# EAGLE design Z05_C8V_02 (EAGLE 6.3)
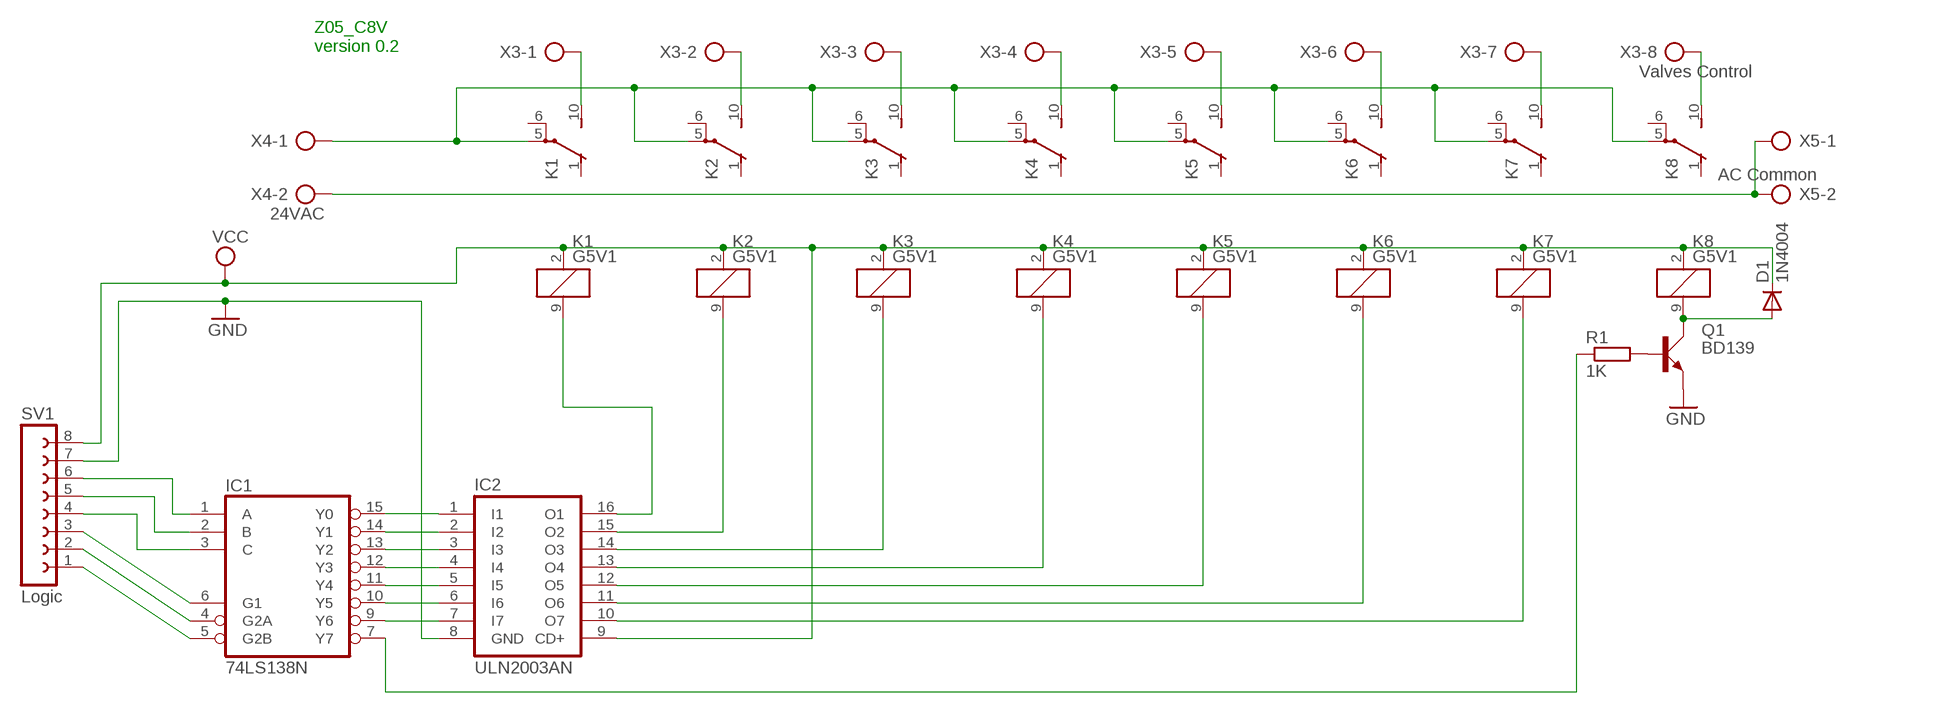
[diagram p0: schematic, sheet 1]

## Parts
D1  1N4004  [DO41-10]
IC1  74LS138N  [DIL16]
IC2  ULN2003AN  [DIL16]
K1  G5V1  [G5V1]
K2  G5V1  [G5V1]
K3  G5V1  [G5V1]
K4  G5V1  [G5V1]
K5  G5V1  [G5V1]
K6  G5V1  [G5V1]
K7  G5V1  [G5V1]
K8  G5V1  [G5V1]
Q1  BD139  [TO126AV]
R1  1K  R-EU_0204/7  [0204/7]
SV1  Logic  FE08-1  [FE08]
X3  Valves Control  AK500/8  [AK500/8]
X4  24VAC  AK500/2  [AK500/2]
X5  AC Common  AK500/2  [AK500/2]

## Nets
GND: IC2.8(GND) Q1.E SV1.7
N$1: IC2.15(O2) K2.9
N$2: IC1.15(Y0) IC2.1(I1)
N$3: IC1.13(Y2) IC2.3(I3)
N$4: IC1.12(Y3) IC2.4(I4)
N$5: IC1.11(Y4) IC2.5(I5)
N$6: IC1.10(Y5) IC2.6(I6)
N$7: IC1.9(Y6) IC2.7(I7)
N$8: K1.5(2:P) K2.5(2:P) K3.5(2:P) K4.5(2:P) K5.5(2:P) K6.5(2:P) K7.5(2:P) K8.5(2:P) X4.1
N$9: IC1.14(Y1) IC2.2(I2)
N$10: X4.2 X5.1 X5.2
N$11: K1.10(2:S) X3.1
N$12: K2.10(2:S) X3.2
N$13: K3.10(2:S) X3.3
N$14: K4.10(2:S) X3.4
N$15: K5.10(2:S) X3.5
N$16: K6.10(2:S) X3.6
N$17: K7.10(2:S) X3.7
N$18: K8.10(2:S) X3.8
N$20: D1.A K8.9 Q1.C
N$21: IC2.16(O1) K1.9
N$22: Q1.B R1.2
N$23: IC1.7(Y7) R1.1
N$24: IC2.14(O3) K3.9
N$25: IC2.13(O4) K4.9
N$26: IC2.12(O5) K5.9
N$27: IC2.11(O6) K6.9
N$28: IC2.10(O7) K7.9
N$42: IC1.1(A) SV1.6
N$43: IC1.2(B) SV1.5
N$44: IC1.3(C) SV1.4
N$45: IC1.6(G1) SV1.3
N$46: IC1.4(G2A) SV1.2
N$47: IC1.5(G2B) SV1.1
VCC: D1.C IC2.9(CD+) K1.2 K2.2 K3.2 K4.2 K5.2 K6.2 K7.2 K8.2 SV1.8
Unconnected: K1.1(2:O) K1.6(2:P) K2.1(2:O) K2.6(2:P) K3.1(2:O) K3.6(2:P) K4.1(2:O) K4.6(2:P) K5.1(2:O) K5.6(2:P) K6.1(2:O) K6.6(2:P) K7.1(2:O) K7.6(2:P) K8.1(2:O) K8.6(2:P)

## Notes on the sheet
- Z05_C8V
  version 0.2

## Power pins joined to a net without a drawn wire
GND: IC1.8(GND)
VCC: IC1.16(VCC)

## Library data of the parts
D1 = diode:1N4004: DIODE general purpose rectifier, 1 A
IC1 = 74xx-eu:74*138: 3-line to 8-line DECODER/DEMULTIPLEXER
IC2 = uln-udn:ULN2003A: DRIVER ARRAY
K1-K8 = relay:G5V1: RELAY 1 x switch, 0.5 A/125 V AC, 1 A/24 V DC , Omron; MPN: G5V-1-DC24; OC_FARNELL: 9949593; OC_NEWARK: 36M6377
Q1 = transistor-power:BD139: NPN TRANSISTOR
R1 = rcl:R-EU_: RESISTOR, European symbol
SV1 = con-lsta:FE08-1: FEMALE HEADER; OC_FARNELL: unknown; OC_NEWARK: unknown
X3 = con-ptr500:AK500/8: CONNECTOR; OC_FARNELL: unknown; OC_NEWARK: unknown
X4 X5 = con-ptr500:AK500/2: CONNECTOR; OC_FARNELL: unknown; OC_NEWARK: unknown

## Board
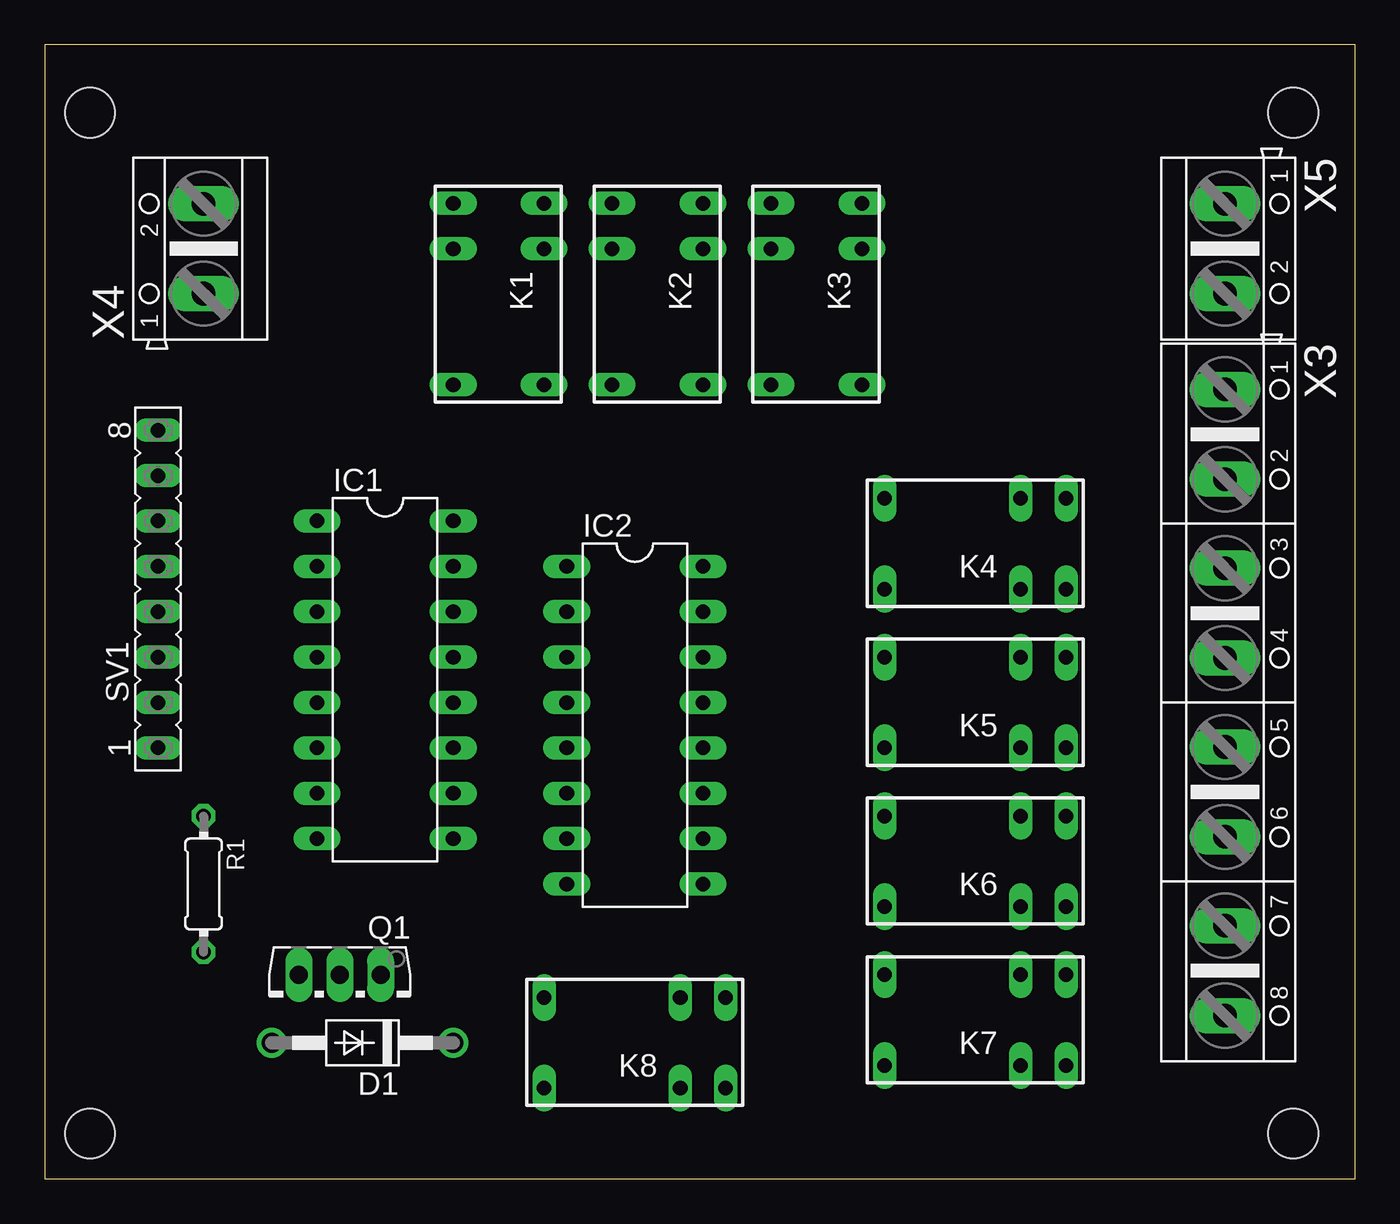
[diagram p1: board, top side]
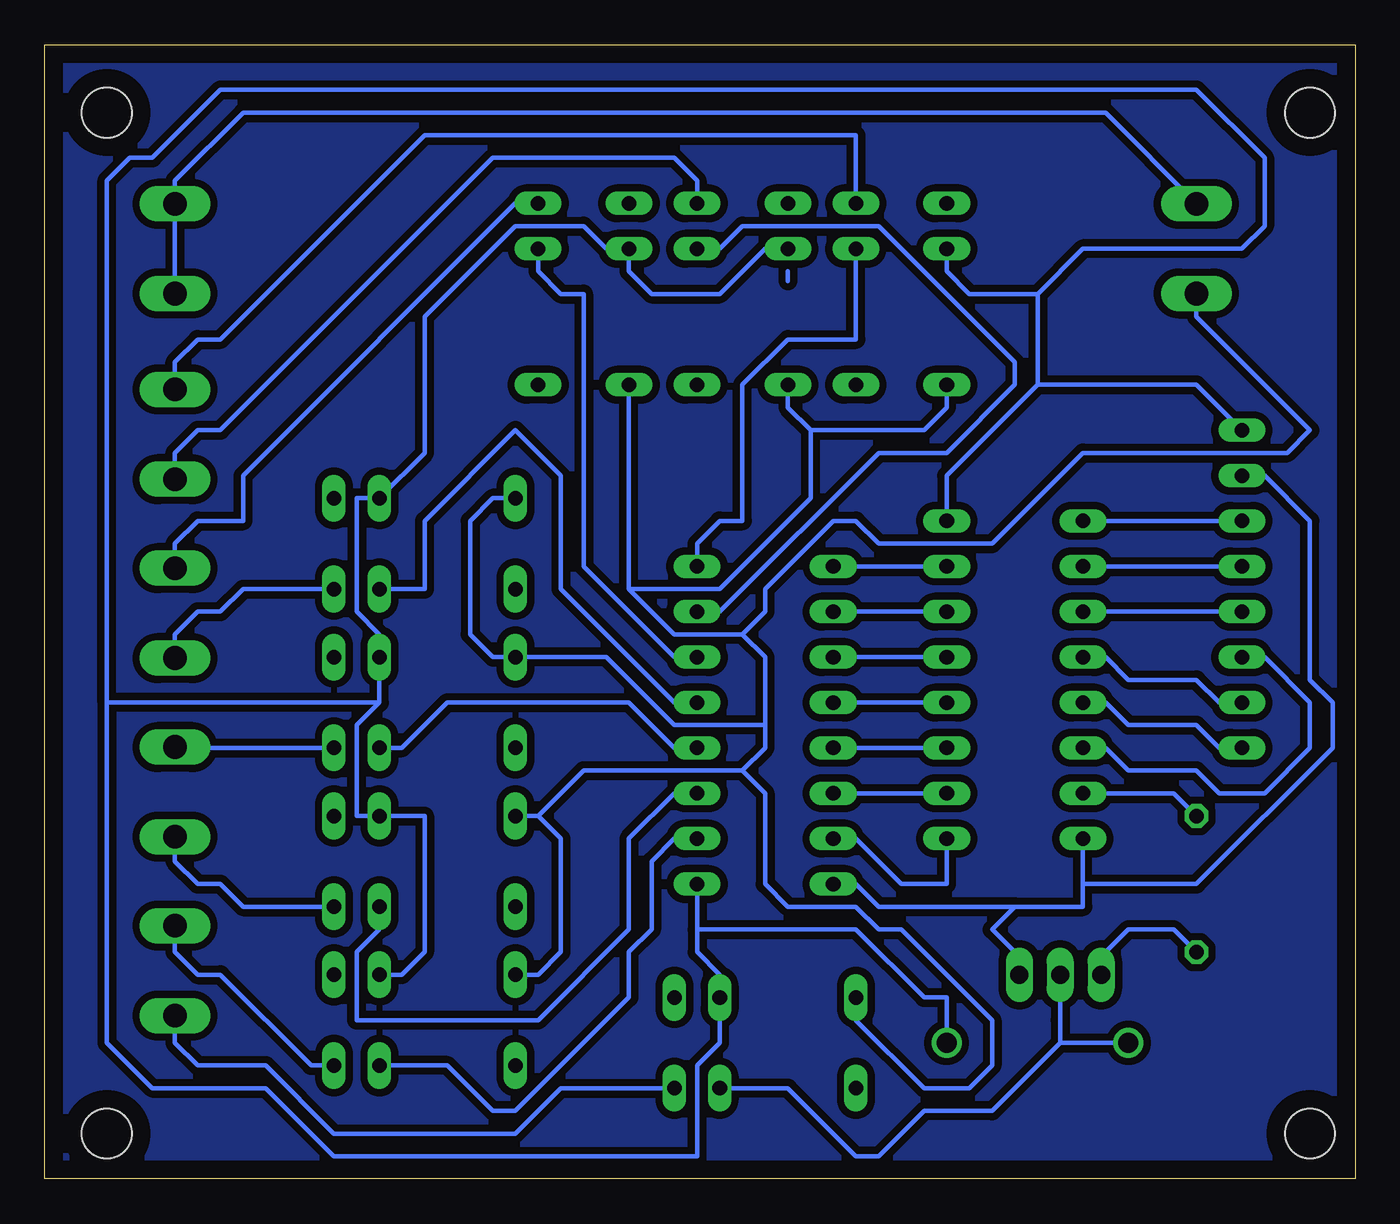
[diagram p2: board, bottom side, seen from below]

Size 73.33 x 63.49 mm. Coordinates in mm from the lower left corner, seen from the top.
Outline: 0,0 73.33,0 73.33,63.49 0,63.49 0,0
Copper layers (1*16): Top 0mil / dielectric 1.5mm / Bottom 0.035mm
Design rules "default *": minimum track width 10mil, minimum drill 24mil, track to track 16mil, track to pad 16mil, pad to pad 16mil, via to via 16mil, smd to smd 8mil, copper to edge 40mil, drill to drill 8mil, minimum pad ring 10mil, minimum via ring 8mil, stop-mask expansion 4mil, vias tented up to drill 0mil, thermal gap 10mil
Holes 2.8 mm at 2.54,59.69 2.54,2.54 69.85,59.69 69.85,2.54

### Footprints (pad centres in the part's own frame; a part is rotated, then mirrored left to right if it is on the bottom)
DO41-10 = drill 1.118: A 5.08,0; C -5.08,0
DIL16 = drill 0.813 long: 1 -8.89,-3.81; 2 -6.35,-3.81; 3 -3.81,-3.81; 4 -1.27,-3.81; 5 1.27,-3.81; 6 3.81,-3.81; 7 6.35,-3.81; 8 8.89,-3.81; 9 8.89,3.81; 10 6.35,3.81; 11 3.81,3.81; 12 1.27,3.81; 13 -1.27,3.81; 14 -3.81,3.81; 15 -6.35,3.81; 16 -8.89,3.81
G5V1 = drill 0.813 long: 1 -5.08,-2.54; 2 -2.54,-2.54; 5 5.08,-2.54; 6 5.08,2.54; 9 -2.54,2.54; 10 -5.08,2.54
TO126AV = drill 1.016 long: B 2.286,-1.27; C 0,-1.27; E -2.286,-1.27
0204/7 = drill 0.813 octagon: 1 -3.81,0; 2 3.81,0
FE08 = drill 0.813 long: 1 -8.89,0; 2 -6.35,0; 3 -3.81,0; 4 -1.27,0; 5 1.27,0; 6 3.81,0; 7 6.35,0; 8 8.89,0
AK500/8 = drill 1.321 long: 1 -17.526,0; 2 -12.497,0; 3 -7.518,0; 4 -2.489,0; 5 2.489,0; 6 7.518,0; 7 12.497,0; 8 17.526,0
AK500/2 = drill 1.321 long: 1 -2.515,0; 2 2.515,0

### Placement (x,y rotation side)
D1  17.78,7.62 180 top
IC1  19.05,27.94 270 top
IC2  33.02,25.4 270 top
K1  25.4,49.53 270 top
K2  34.29,49.53 270 top
K3  43.18,49.53 270 top
K4  52.07,35.56 180 top
K5  52.07,26.67 180 top
K6  52.07,17.78 180 top
K7  52.07,8.89 180 top
K8  33.02,7.62 180 top
Q1  16.51,10.16 180 top
R1  8.89,16.51 270 top
SV1  6.35,33.02 90 top
X3  66.04,26.67 270 top
X4  8.89,52.07 90 top
X5  66.04,52.07 270 top

### Tracks (layer width: path | path; a pad name or v marks a point on that pad's centre or on a via)
GND
  Bottom 0.254: 15.24,16.51 15.24,15.24 19.05,15.24 | 15.24,16.51 IC1.8 | 19.05,15.24 20.32,13.97 19.05,12.7 19.05,11.43 Q1.E | IC2.8 27.94,16.51 26.67,15.24 19.05,15.24 | SV1.7 5.08,39.37 2.54,36.83 2.54,27.94 1.27,26.67 1.27,24.13 8.89,16.51 15.24,16.51
N$1
  Bottom 0.254: IC2.15 35.56,31.75 26.67,40.64 22.86,40.64 19.05,44.45 19.05,45.72 26.67,53.34 34.29,53.34 35.56,52.07 K2.9
N$2
  Bottom 0.254: IC2.1 IC1.15
N$3
  Bottom 0.254: IC2.3 IC1.13
N$4
  Bottom 0.254: IC2.4 IC1.12
N$5
  Bottom 0.254: IC2.5 IC1.11
N$6
  Bottom 0.254: IC2.6 IC1.10
N$7
  Bottom 0.254: IC1.9 22.86,16.51 25.4,16.51 27.94,19.05 IC2.7
N$8
  Bottom 0.254: K1.5 22.86,43.18 24.13,41.91 30.48,41.91 | 30.48,41.91 31.75,43.18 K2.5 | K4.5 48.26,38.1 49.53,36.83 49.53,30.48 48.26,29.21 K5.5 41.91,29.21 38.1,25.4 33.02,25.4 | K8.5 27.94,8.89 24.13,5.08 21.59,5.08 20.32,6.35 20.32,8.89 25.4,13.97 26.67,13.97 27.94,15.24 31.75,15.24 33.02,16.51 33.02,21.59 34.29,22.86 | 34.29,22.86 43.18,22.86 45.72,20.32 | K6.5 45.72,20.32 | K7.5 45.72,11.43 44.45,12.7 44.45,19.05 45.72,20.32 | 40.64,33.02 K3.5 | 40.64,33.02 38.1,30.48 34.29,30.48 | 34.29,30.48 33.02,29.21 33.02,25.4 | 33.02,25.4 33.02,24.13 34.29,22.86 | X4.1 8.89,48.26 2.54,41.91 3.81,40.64 15.24,40.64 20.32,35.56 26.67,35.56 27.94,36.83 29.21,36.83 33.02,33.02 33.02,31.75 34.29,30.48 | 30.48,41.91 30.48,38.1 35.56,33.02 40.64,33.02
N$9
  Bottom 0.254: IC2.2 IC1.14
N$10
  Bottom 0.254: X4.2 13.97,59.69 62.23,59.69 66.04,55.88 X5.1 X5.2 66.04,49.53
N$11
  Bottom 0.254: K1.10 27.94,58.42 52.07,58.42 63.5,46.99 64.77,46.99 66.04,45.72 X3.1
N$12
  Bottom 0.254: K2.10 36.83,55.88 38.1,57.15 48.26,57.15 63.5,41.91 64.77,41.91 66.04,40.64 X3.2
N$13
  Bottom 0.254: K3.10 46.99,54.61 62.23,39.37 62.23,36.83 64.77,36.83 66.04,35.56 X3.3
N$14
  Bottom 0.254: K4.10 62.23,33.02 63.5,31.75 64.77,31.75 66.04,30.48 X3.4
N$15
  Bottom 0.254: K5.10 66.04,24.13 X3.5
N$16
  Bottom 0.254: K6.10 62.23,15.24 63.5,16.51 64.77,16.51 66.04,17.78 X3.6
N$17
  Bottom 0.254: K7.10 58.42,6.35 63.5,11.43 64.77,11.43 66.04,12.7 X3.7
N$18
  Bottom 0.254: K8.10 44.45,5.08 46.99,2.54 57.15,2.54 60.96,6.35 64.77,6.35 66.04,7.62 X3.8
N$19
  Bottom 0.254: 31.75,50.8 31.75,50.27
N$20
  Bottom 0.254: K8.9 31.75,5.08 27.94,1.27 26.67,1.27 24.13,3.81 20.32,3.81 16.51,7.62 | 16.51,7.62 16.51,8.89 Q1.C | 16.51,7.62 D1.A
N$21
  Bottom 0.254: K1.9 27.94,46.99 31.75,46.99 34.29,44.45 34.29,36.83 35.56,36.83 36.83,35.56 IC2.16
N$22
  Bottom 0.254: R1.2 10.16,13.97 12.7,13.97 13.97,12.7 13.97,11.43 Q1.B
N$23
  Bottom 0.254: R1.1 10.16,21.59 IC1.7
N$24
  Bottom 0.254: IC2.14 38.1,29.21 43.18,34.29 43.18,49.53 44.45,49.53 45.72,50.8 K3.9
N$25
  Bottom 0.254: IC2.13 38.1,26.67 44.45,33.02 44.45,39.37 46.99,41.91 52.07,36.83 52.07,33.02 K4.9
N$26
  Bottom 0.254: IC2.12 38.1,24.13 40.64,26.67 50.8,26.67 53.34,24.13 K5.9
N$27
  Bottom 0.254: K6.9 54.61,13.97 55.88,12.7 55.88,8.89 45.72,8.89 40.64,13.97 40.64,19.05 38.1,21.59 IC2.11
N$28
  Bottom 0.254: K7.9 50.8,6.35 48.26,3.81 46.99,3.81 40.64,10.16 40.64,12.7 39.37,13.97 39.37,17.78 38.1,19.05 IC2.10
N$29
  pour Bottom: 0,0 0,63.5 73.66,63.5 73.66,0
N$42
  Bottom 0.254: IC1.1 SV1.6
N$43
  Bottom 0.254: IC1.2 SV1.5
N$44
  Bottom 0.254: IC1.3 SV1.4
N$45
  Bottom 0.254: SV1.3 5.08,29.21 2.54,26.67 2.54,24.13 5.08,21.59 7.62,21.59 8.89,22.86 12.7,22.86 13.97,24.13 IC1.6
N$46
  Bottom 0.254: SV1.2 7.62,26.67 8.89,27.94 12.7,27.94 13.97,29.21 IC1.4
N$47
  Bottom 0.254: SV1.1 7.62,24.13 8.89,25.4 12.7,25.4 13.97,26.67 IC1.5
VCC
  Bottom 0.254: IC1.16 22.86,39.37 17.78,44.45 | 17.78,49.53 17.78,44.45 | 17.78,49.53 21.59,49.53 22.86,50.8 K1.2 | SV1.8 8.89,44.45 17.78,44.45 | IC2.9 36.83,13.97 | 36.83,13.97 36.83,12.7 35.56,11.43 K8.2 35.56,7.62 36.83,6.35 36.83,1.27 57.15,1.27 60.96,5.08 67.31,5.08 69.85,7.62 69.85,26.67 | D1.C 22.86,10.16 24.13,10.16 27.94,13.97 36.83,13.97 | K2.2 33.02,52.07 35.56,49.53 39.37,49.53 40.64,50.8 K3.2 41.91,52.07 43.18,53.34 46.99,53.34 52.07,48.26 52.07,40.64 K4.2 55.88,38.1 55.88,31.75 54.61,30.48 K5.2 54.61,26.67 | K7.2 53.34,11.43 52.07,12.7 52.07,20.32 K6.2 55.88,20.32 55.88,25.4 54.61,26.67 | 54.61,26.67 69.85,26.67 | 17.78,49.53 15.24,52.07 6.35,52.07 5.08,53.34 5.08,57.15 8.89,60.96 63.5,60.96 67.31,57.15 68.58,57.15 69.85,55.88 69.85,26.67